# EAGLE design brick_analog_ir_receive (EAGLE 7.4.0)
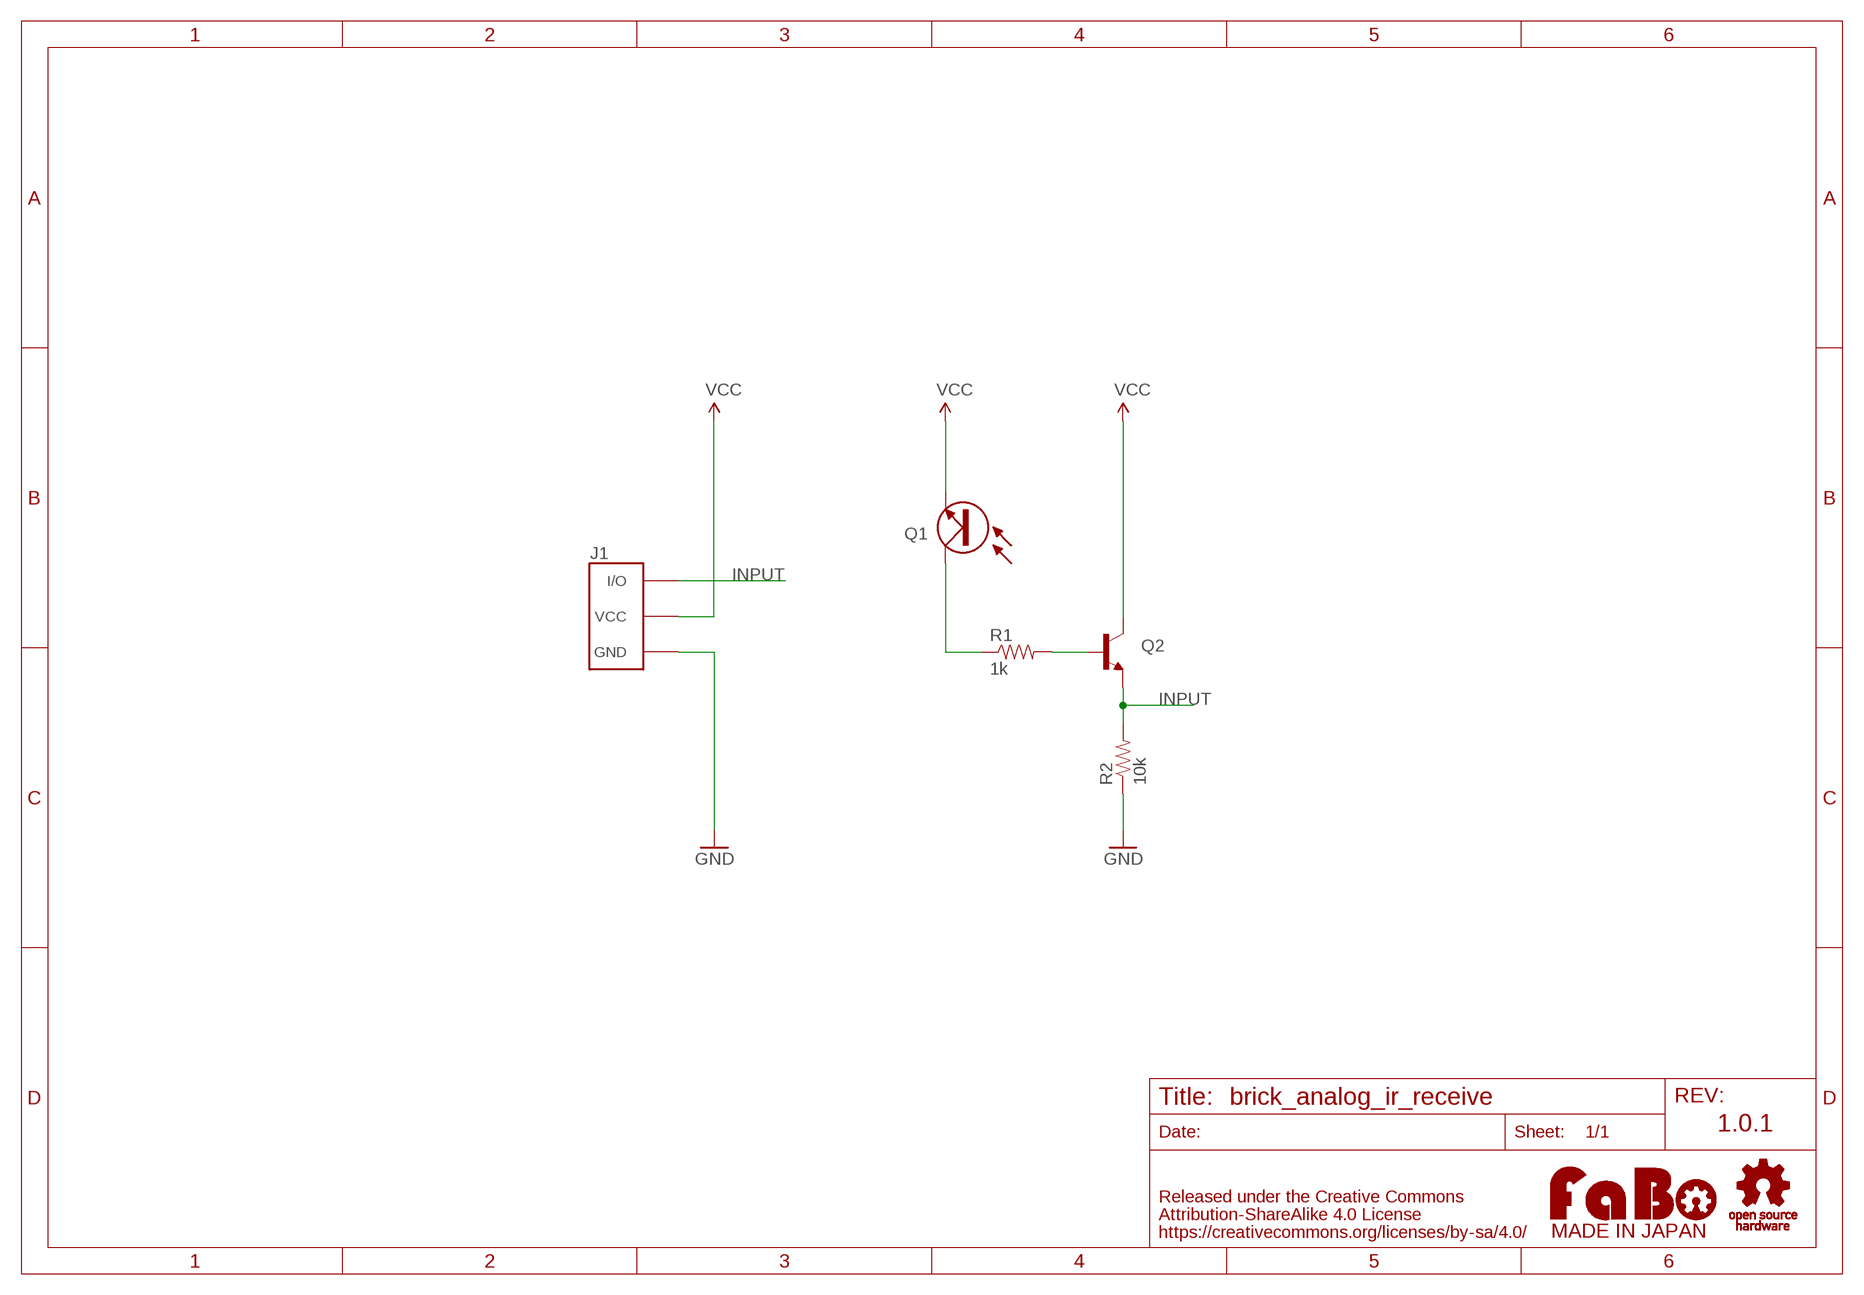
[diagram p0: schematic, sheet 1]

## Parts
J1  FABO_BRICK_3PIN  [FABO_BRICK_3PIN]
Q1  L-51ROPT1D1  [LED-5MM]
Q2  NPN-2SC1815  [TO-92]
R1  1k  RES-PTH-REGULAR  [RES-AXL-REGULAR]
R2  10k  RES-PTH-REGULAR  [RES-AXL-REGULAR]
U$5  LOGO_FABO-M  [LOGO_FABO_M]
U$6  LOGO_OSHW-T_M  [LOGO_OSHW_T_M]

## Nets
GND: J1.GND R2.P$1
INPUT: J1.IN/OUT(I/O) Q2.E R2.P$2
N$5: Q1.K(C) R1.P$1
N$6: Q2.B R1.P$2
VCC: J1.VCC Q1.A(E) Q2.C

## Notes on the sheet
- 1.0.1

## Library data of the parts
J1 = FaBo-Template:FABO_BRICK_3PIN: FaBo Brick 3pin
Q1 = FaBo-etc:L-51ROPT1D1
Q2 = FaBo-etc:NPN
R1 R2 = FaBo-etc:RES
U$5 = FaBo-etc:LOGO_FABO
U$6 = FaBo-etc:LOGO_OSHW

## Board
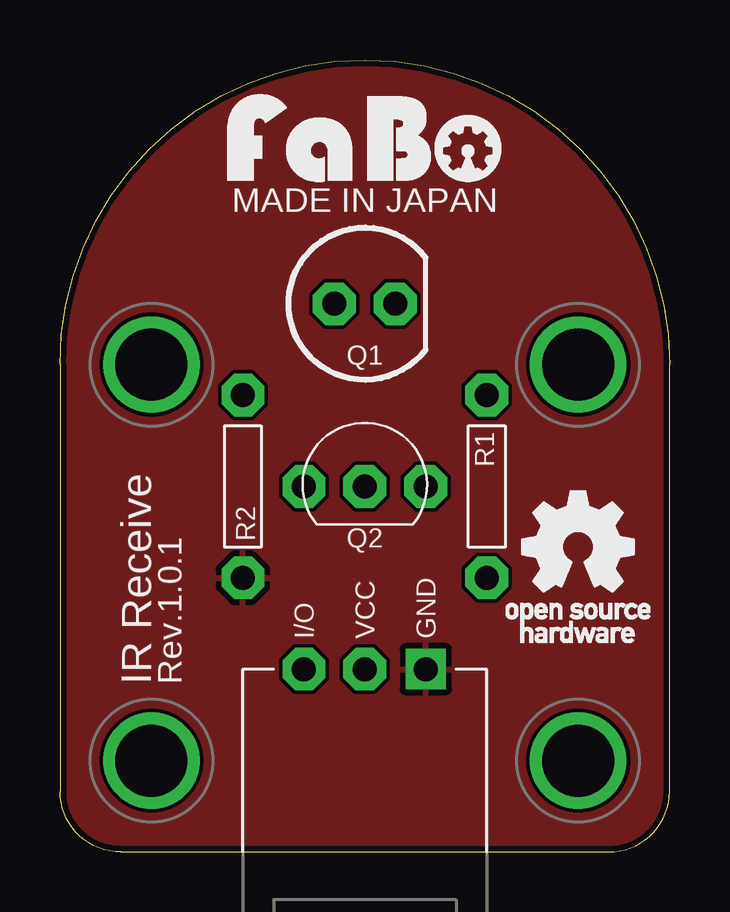
[diagram p1: board, top side]
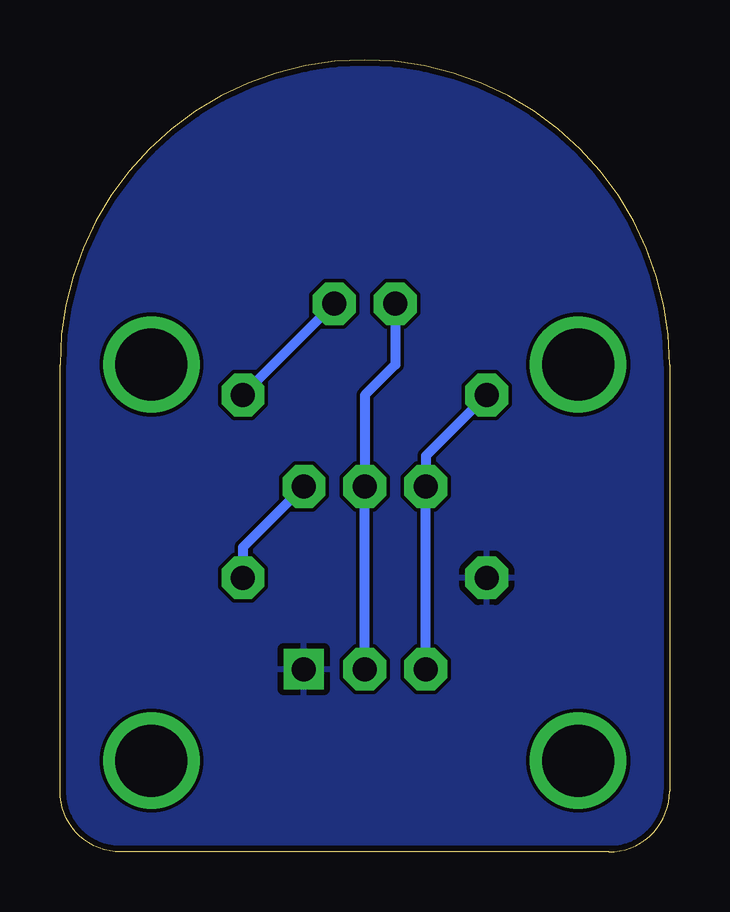
[diagram p2: board, bottom side, seen from below]

Size 25.4 x 33.02 mm. Coordinates in mm from the lower left corner, seen from the top.
Copper layers (1*16): Top 0.035mm / dielectric 1.5mm / Bottom 0.035mm
Design rules "Elecrow_2-layer_eagle_rule": minimum track width 6mil, minimum drill 12mil, track to track 6mil, track to pad 6mil, pad to pad 6mil, via to via 6mil, smd to smd 0mil, copper to edge 10mil, drill to drill 10mil, minimum pad ring 10mil, minimum via ring 6mil, stop-mask expansion 2mil, vias tented up to drill 100mil, thermal gap 10mil

### Footprints (pad centres in the part's own frame; a part is rotated, then mirrored left to right if it is on the bottom)
FABO_BRICK_3PIN = drill 1 pad 1.676 square: GND 2.54,-8.89 | drill 1 pad 1.778 octagon: IN/OUT -2.54,-8.89; VCC 0,-8.89 | drill 3 pad 3.81: P$5 -8.89,3.81; P$6 8.89,3.81; P$7 -8.89,-12.7; P$8 8.89,-12.7
LED-5MM = drill 1 pad 1.778 octagon: A -1.27,0; K 1.27,0
TO-92 = drill 1 pad 1.778 octagon: B 2.54,0; C 0,0; E -2.54,0
RES-AXL-REGULAR = drill 1 pad 1.778 octagon: P$1 -3.81,0; P$2 3.81,0

### Placement (x,y rotation side)
J1  12.7,16.51 0 top
Q1  12.7,22.86 0 top
Q2  12.7,15.24 0 top
R1  17.78,15.24 270 top
R2  7.62,15.24 90 top
U$5  12.7,27.94 0 top
U$6  21.59,12.7 0 top

### Tracks (layer width: path | path; a pad name or v marks a point on that pad's centre or on a via)
GND
  pour Bottom: -1.27,-1.27 26.67,-1.27 26.67,34.29 -1.27,34.29
  pour Top: -1.27,-1.27 26.67,-1.27 26.67,34.29 -1.27,34.29
INPUT
  Bottom 0.406: J1.IN/OUT Q2.E 10.16,16.51 R2.P$2
N$5
  Bottom 0.406: Q1.K R1.P$1
N$6
  Bottom 0.406: Q2.B 17.78,12.7 R1.P$2
VCC
  Bottom 0.406: J1.VCC Q2.C 12.7,19.05 11.43,20.32 Q1.A

### Text on the board
tPlace: MADE IN JAPAN | IR Receive | Rev.1.0.1